# EasyEDA Pro project New Project_2025-09-08_15-52-52.eprj

# Schematic STM32F103C8T6最小系统板原理图
Board Name: Board1; Create Date: 2025-09-08; Page Name: P1; Project Name: New Project_2025-09-08_15-52-52; Schematic Name: STM32F103C8T6最小系统板原理图; Update Date: 2025-09-09; Company: 嘉立创EDA; Page Size: A4; Version: V1.0
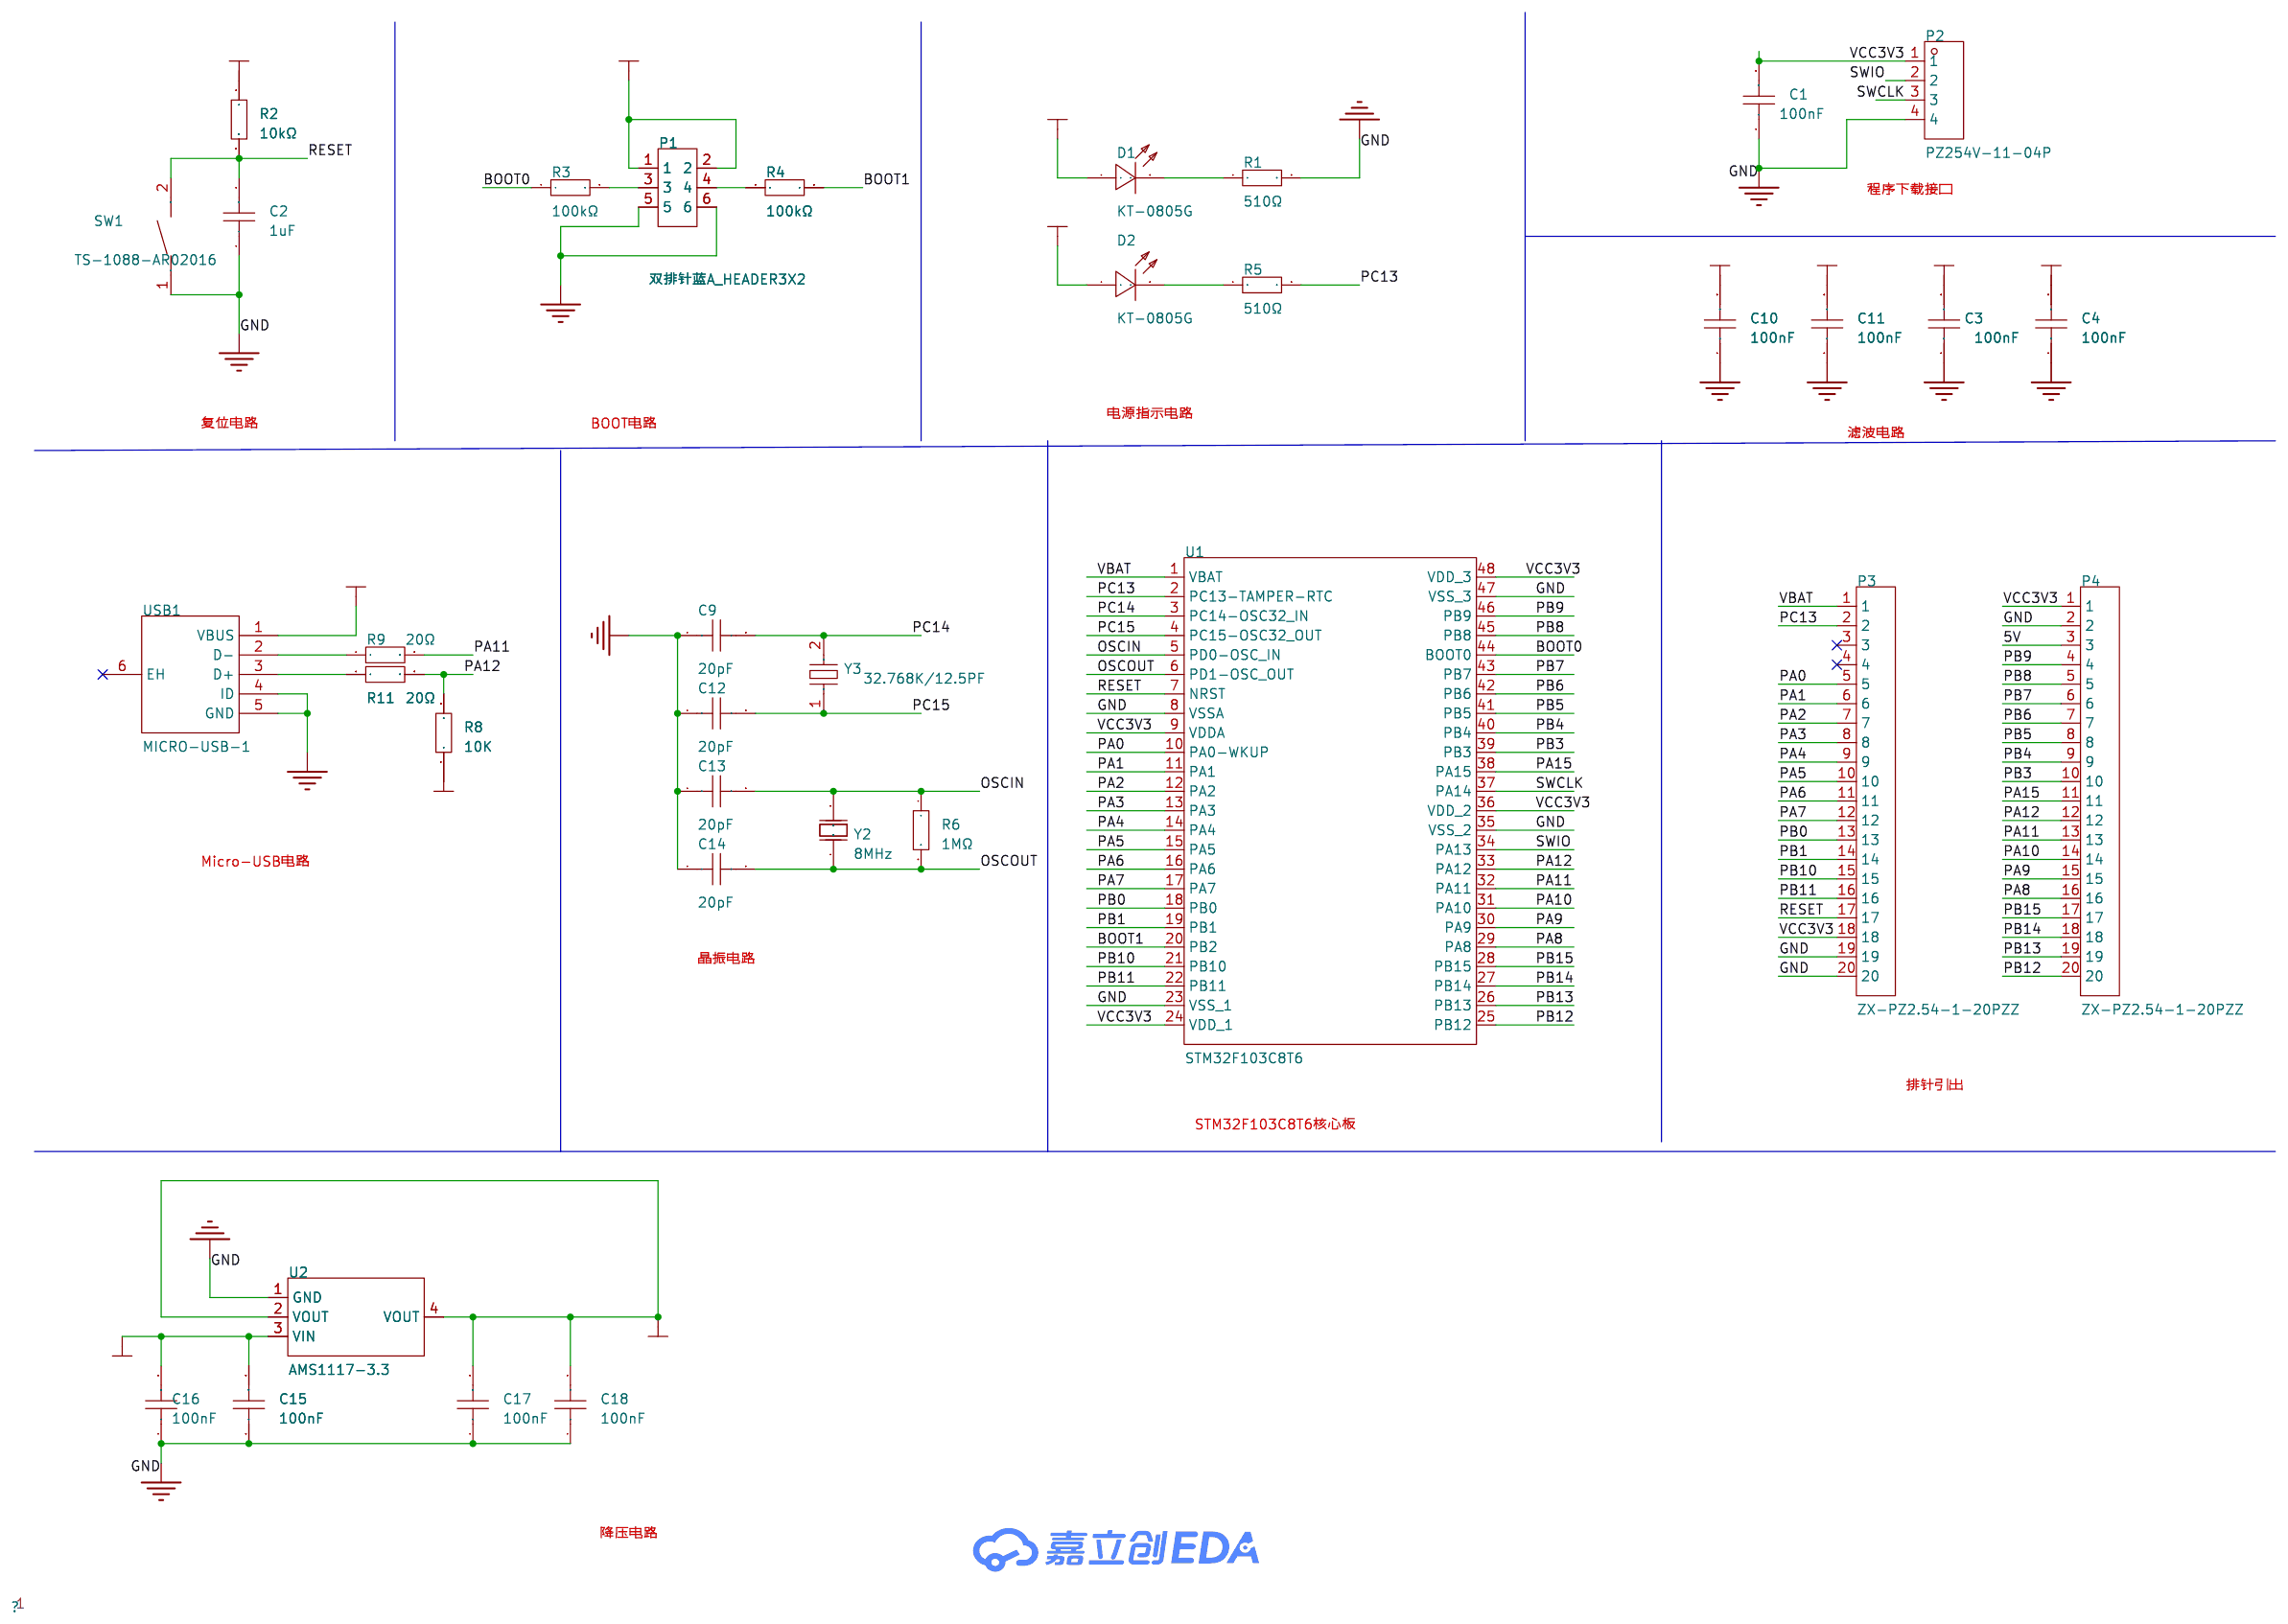
[diagram p0: schematic sheet]

## Parts
C1  100nF  [C0603]
C2  1uF  [C0603]
C3  100nF  [C0603]
C4  100nF  [C0603]
C9  20pF  [C0603]
C10  100nF  [C0603]
C11  100nF  [C0603]
C12  20pF  [C0603]
C13  20pF  [C0603]
C14  20pF  [C0603]
C15  100nF  [C0603]
C16  100nF  [C0603]
C17  100nF  [C0603]
C18  100nF  [C0603]
D1  KT-0805G  [LED0805-R-RD]
D2  KT-0805G  [LED0805-R-RD]
P1  双排针蓝A_HEADER3X2  [HDR-TH_6P-P2.54-V-M-R2-C3-S2.54-1]
P2  PZ254V-11-04P  [HDR-TH_4P-P2.54-V-M]
P3  ZX-PZ2.54-1-20PZZ  [HDR-TH_20P-P2.54-V-M]
P4  ZX-PZ2.54-1-20PZZ  [HDR-TH_20P-P2.54-V-M]
R1  510Ω  [R0603]
R2  10kΩ  [R0603]
R3  100kΩ  [R0603]
R4  100kΩ  [R0603]
R5  510Ω  [R0603]
R6  1MΩ  [R0603]
R8  10K  [R0603]
R9  20Ω  [R0603]
R11  20Ω  [R0603]
SW1  TS-1088-AR02016  [SW-SMD_L3.9-W3.0-P4.45]
U1  STM32F103C8T6  [LQFP-48_L7.0-W7.0-P0.50-LS9.0-BL]
U2  AMS1117-3.3  [SOT-223-3_L6.5-W3.4-P2.30-LS7.0-BR]
USB1  MICRO-USB-1  [MICRO-USB-SMD_C9900008946]
Y2  8MHz  [HC-49U_L10.9-W4.5-P4.88]
Y3  32.768K/12.5PF  [CRYSTAL-SMD_L3.2-W1.5-1]

## Library data of the parts
C1-C4 C9-C18 = CAP_0603: Supplier Footprint: 0603
D1 D2 = KT-0805G: LCSC Part Name: 0805 翠绿 高亮; Supplier Part: C2297; Manufacturer: KENTO; Supplier Footprint: 0805; JLCPCB Part Class: 基础库; Datasheet: https://item.szlcsc.com/datasheet/KT-0805G/2670.html; Supplier: LCSC; Illumination Color: 翠绿色; Voltage - Forward(Vf): 2.6V~3.1V; Power(Watts): 100mW; Forward Current: 5mA; Wavelength - Dominant: 513nm~528nm; Peak Wavelength: 525nm; Luminous Intensity: 430mcd; Viewing Angle: 120°; Operating Temperature: -40℃~+85℃
P1 = 双排针蓝A_HEADER3X2: Supplier Part: C9900019268; Supplier Footprint: HDR2X3_254M; JLCPCB Part Class: 扩展库; Supplier: LCSC
P2 = PZ254V-11-04P: LCSC Part Name: 1x4P 间距:2.54mm 方针 直插; Supplier Part: C2691448; Manufacturer: XFCN(兴飞); Supplier Footprint: 插件,P=2.54mm; JLCPCB Part Class: 扩展库; Datasheet: https://item.szlcsc.com/datasheet/PZ254V-11-04P/2801085.html; Supplier: LCSC; Pin Structure: 1x4P; Pitch: 2.54mm; Circluar Pins/Square Pins: 方针; Mounting Type: 直插; Number of Rows: 单排; Number of Pins: 4P; Current Rating: 3A; Voltage Rating (Max): 250V; Length of Mating Pin: 6mm; Insulation Height: 2.5mm; Length of End Connection Pin: 3mm; Operating Temperature: -40℃~+105℃; Color: 黑色
P3 P4 = ZX-PZ2.54-1-20PZZ: LCSC Part Name: 1x20P 间距:2.54mm 方针 直插; Supplier Part: C7501271; Manufacturer: Megastar(兆星); Supplier Footprint: 插件,P=2.54mm; JLCPCB Part Class: 扩展库; Datasheet: https://item.szlcsc.com/datasheet/ZX-PZ2.54-1-20PZZ/8582484.html; Supplier: LCSC; Pin Structure: 1x20P; Pitch: 2.54mm; Circluar Pins/Square Pins: 方针; Mounting Type: 直插; Number of Rows: 单排; Number of Pins: 20P; Current Rating: 3A; Length of Mating Pin: 6mm; Insulation Height: 2.5mm; Length of End Connection Pin: 3mm; Contact Material: 黄铜; Contact Plating: 金; Operating Temperature: -40℃~+105℃; Color: 黑色
R1-R6 R8 R9 R11 = Res_0603: Supplier Footprint: 0603
SW1 = TS-1088-AR02016: LCSC Part Name: 4*3*2mm 立贴 轻触开关; Supplier Part: C720477; Manufacturer: XUNPU(讯普); Supplier Footprint: SMD; JLCPCB Part Class: 基础库; Datasheet: https://item.szlcsc.com/datasheet/TS-1088-AR02016/763484.html; Supplier: LCSC; Circuit: 单刀单掷; Actuator Style: 圆形按钮; Operating Force: 1.6N; Mounting Type: 立贴; Length: 4mm; Width: 3mm; Switch Height: 2mm; with Bracket: 不带支架; Contact Current: 50mA; Voltage Rating: 12V; Actuator/Cap Color: 黑色; Termination Style: SMD接片; Life: 10万次; Operating Temperature: -30℃~+80℃
U1 = STM32F103C8T6: LCSC Part Name: 主流增强型ARM Cortex-M3 MCU，具有64 KB Flash、72 MHz CPU、电机控制、USB和CAN; Supplier Part: C8734; Manufacturer: ST(意法半导体); Supplier Footprint: LQFP-48(7x7); JLCPCB Part Class: 扩展库; Datasheet: https://item.szlcsc.com/datasheet/STM32F103C8T6/9243.html; Supplier: LCSC; CPU Core: ARM-M3; CPU Maximum Speed: 72MHz; Program Storage Size: 64KB; Program Memory Type: FLASH; Number of I/O: 37; ADC (Bit): 12bit; Voltage - Supply: 2V~3.6V
U2 = AMS1117-3.3_C6186: LCSC Part Name: 输出3.3V 1A; Supplier Part: C6186; Manufacturer: AMS; Supplier Footprint: SOT-223; JLCPCB Part Class: 基础库; Datasheet: https://item.szlcsc.com/datasheet/AMS1117-3.3/6652.html; Supplier: LCSC; Output Type: 固定; Voltage - Supply: 16V; Output Voltage: 3.3V; Output Current: 1A; Power Supply Rejection Ratio (PSRR): 72dB@(120Hz); Voltage Dropout: 1.1V@(800mA); standby current: 5mA; Features: 过流保护；过热保护; Operating Temperature: -40℃~+125℃; Output Configuration: 正极; Number of Outputs: 1
USB1 = MICRO-USB-1: Supplier Part: C9900008946; Supplier Footprint: USB-micro; JLCPCB Part Class: 扩展库; Supplier: LCSC
Y2 = ATS080SM-1: LCSC Part Name: 8MHz ±30ppm; Supplier Part: C1985742; Manufacturer: CTS(西迪斯); Supplier Footprint: HC-49S; JLCPCB Part Class: 扩展库; Datasheet: https://atta.szlcsc.com/upload/public/pdf/source/20220124/B9986DAB42ECDE31CA8A9C6A4A6F535C.pdf; Supplier: LCSC; Normal temperature Frequency Tolerance: ±30ppm; Frequency Stability(Full temperature range): ±50ppm; Equivalent Series Resistance (ESR): 60Ω; Operating Temperature: -20℃~+70℃
Y3 = 32.768K/12.5PF: Supplier Part: C9900014970; Supplier Footprint: 32.768KHz; JLCPCB Part Class: 扩展库; Supplier: LCSC

## Nets
5V: C15.2 C16.2 P4.3 R8.1 U2.3(VIN) USB1.1(VBUS)
GND: C1.1 C2.1 C3.1 C4.1 C9.1 C10.1 C11.1 C12.1 C13.1 C14.1 C15.1 C16.1 C17.1 C18.1 P1.5 P1.6 P2.4 P3.19 P3.20 P4.2 R1.2 SW1.1 U1.8(VSSA) U1.23(VSS_1) U1.35(VSS_2) U1.47(VSS_3) U2.1(GND) USB1.4(ID) USB1.5(GND)
VBAT: P3.1 U1.1(VBAT)
VCC3V3: C1.2 C3.2 C4.2 C10.2 C11.2 C17.2 C18.2 D1.1(A) D2.1(A) P1.1 P1.2 P2.1 P3.18 P4.1 R2.1 U1.9(VDDA) U1.24(VDD_1) U1.36(VDD_2) U1.48(VDD_3) U2.2(VOUT) U2.4(VOUT)
BOOT0: R3.1 U1.44(BOOT0)
BOOT1: R4.2 U1.20(PB2)
OSCIN: C13.2 R6.1 U1.5(PD0-OSC_IN) Y2.2(OSC2)
OSCOUT: C14.2 R6.2 U1.6(PD1-OSC_OUT) Y2.1(OSC1)
PA0: P3.5 U1.10(PA0-WKUP)
PA1: P3.6 U1.11(PA1)
PA2: P3.7 U1.12(PA2)
PA3: P3.8 U1.13(PA3)
PA4: P3.9 U1.14(PA4)
PA5: P3.10 U1.15(PA5)
PA6: P3.11 U1.16(PA6)
PA7: P3.12 U1.17(PA7)
PA8: P4.16 U1.29(PA8)
PA9: P4.15 U1.30(PA9)
PA10: P4.14 U1.31(PA10)
PA11: P4.13 R9.2 U1.32(PA11)
PA12: P4.12 R8.2 R11.2 U1.33(PA12)
PA15: P4.11 U1.38(PA15)
PB0: P3.13 U1.18(PB0)
PB1: P3.14 U1.19(PB1)
PB3: P4.10 U1.39(PB3)
PB4: P4.9 U1.40(PB4)
PB5: P4.8 U1.41(PB5)
PB6: P4.7 U1.42(PB6)
PB7: P4.6 U1.43(PB7)
PB8: P4.5 U1.45(PB8)
PB9: P4.4 U1.46(PB9)
PB10: P3.15 U1.21(PB10)
PB11: P3.16 U1.22(PB11)
PB12: P4.20 U1.25(PB12)
PB13: P4.19 U1.26(PB13)
PB14: P4.18 U1.27(PB14)
PB15: P4.17 U1.28(PB15)
PC13: P3.2 R5.2 U1.2(PC13-TAMPER-RTC)
PC14: C9.2 U1.3(PC14-OSC32_IN) Y3.2
PC15: C12.2 U1.4(PC15-OSC32_OUT) Y3.1
RESET: C2.2 P3.17 R2.2 SW1.2 U1.7(NRST)
SWCLK: P2.3 U1.37(PA14)
SWIO: P2.2 U1.34(PA13)
$1N1147: P1.3 R3.2
$1N1213: P1.4 R4.1
$1N1574: D1.2(K) R1.1
$1N1677: D2.2(K) R5.1
$1N2421: R9.1 USB1.2(D-)
$1N2425: R11.1 USB1.3(D+)

Not connected (* = marked no-connect by the designer): P3 3* 4*; USB1 6(EH)*

## Notes on the sheet
- 程序下载接口
- 复位电路
- BOOT电路
- 电源指示电路
- 滤波电路
- Micro-USB电路
- 晶振电路
- 排针引出
- STM32F103C8T6核心板
- 降压电路

# Board PCB1
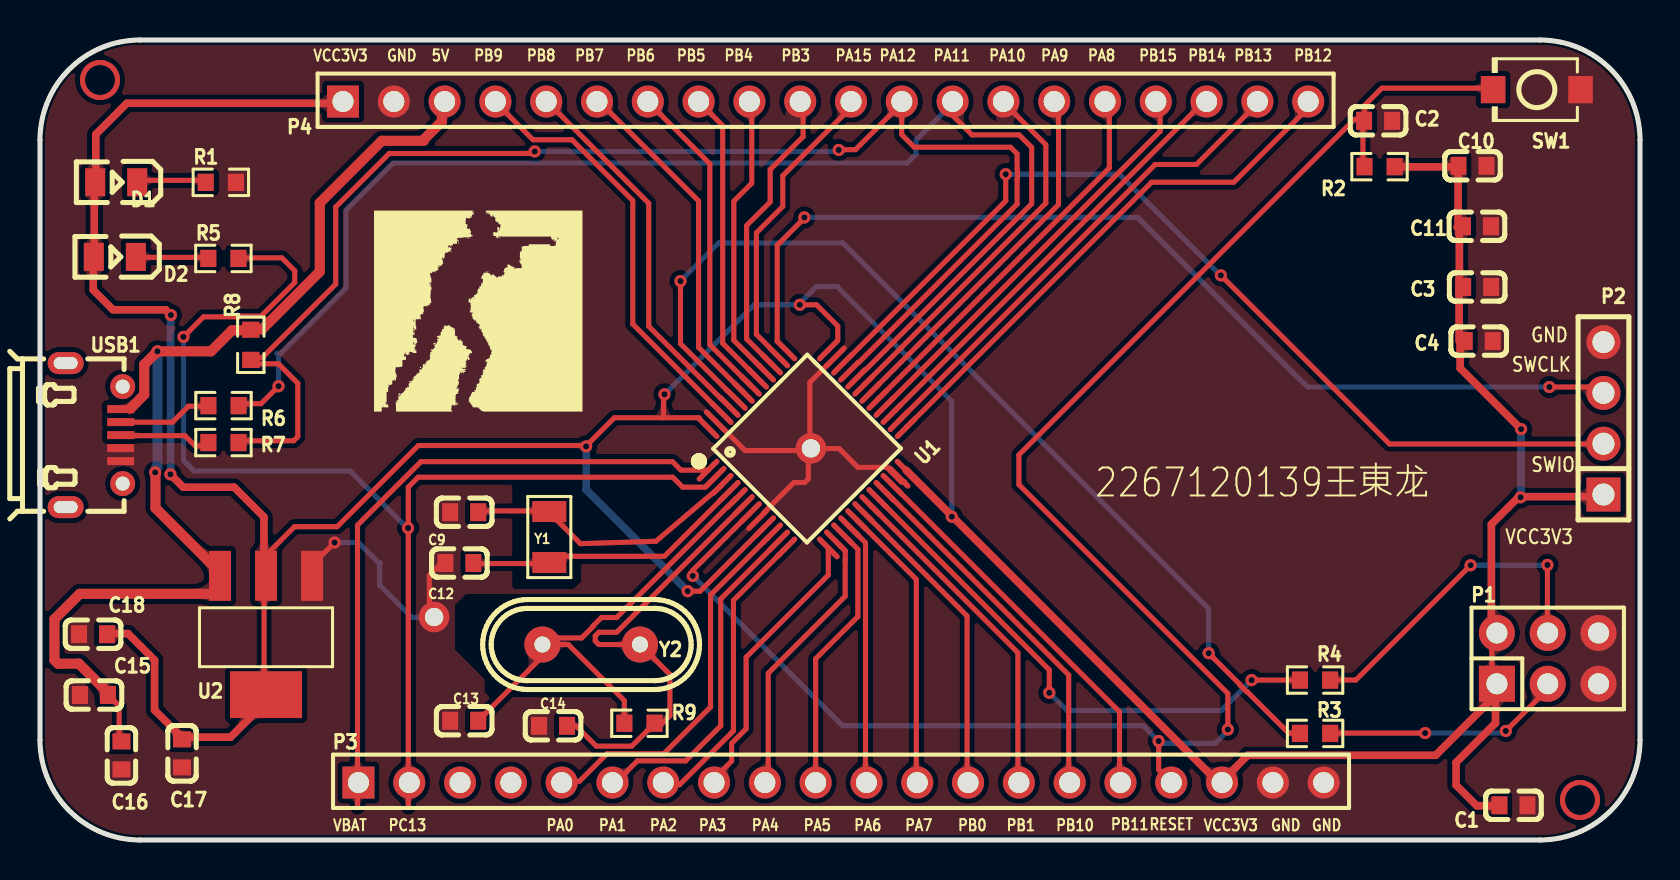
[diagram p1: board, top side]
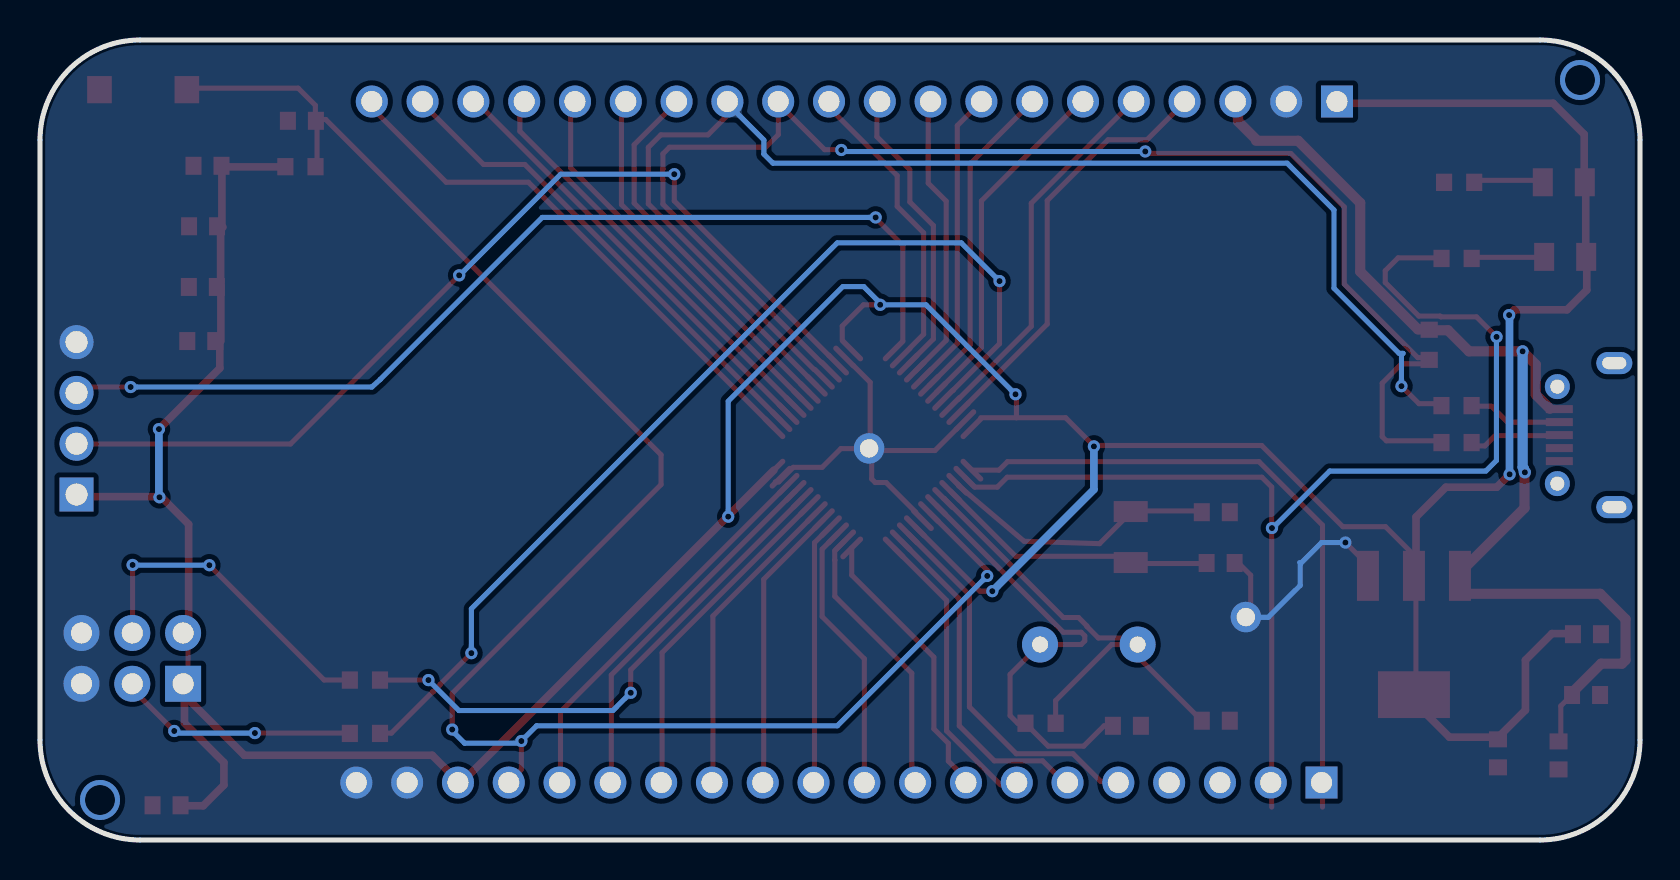
[diagram p2: board, bottom side, seen from below]

Outline 80 x 40 mm; copper layers: Top Layer, Bottom Layer. Coordinates in mm from the lower left corner of the outline.
Outline path: 0,35 0,5 arc(1.46,1.46) 5,0 75,0 arc(78.54,1.46) 80,5 80,35 arc(78.54,38.54) 75,40 5,40 arc(1.46,38.54) 0,35
Stack: Top Layer 0.035mm / Dielectric1 1.51mm FR4 er 4.5 / Bottom Layer 0.035mm

## Design rules (mm)
template: 自定义配置
spacing copperThickness1oz (default): track to track 0.102, other pairs 0.152 to 0.3
spacing copperThickness2oz: track to track 0.203, other pairs 0.152 to 0.3
track width copperThickness1oz (default): min 0.127, default 0.254, max 2.54
track width copperThickness2oz: min 0.203, default 0.254, max 2.54
differential pair differentialPair (default): width min 0.127, default 0.254, max 2.54; gap min 0.152, default 0.152
via viaSize (default): diameter min 0.5, default 0.61, max 10; hole min 0.3, default 0.305, max 6.3

## Placement (name value [footprint] x y rotation side)
C1  100nF  [C0603]  73.67 1.74 180 top
C2  1uF  [C0603]  66.91 35.96 180 top
C3  100nF  [C0603]  71.86 27.65 180 top
C4  100nF  [C0603]  71.94 24.95 180 top
C9  20pF  [C0603]  21.21 16.39 0 top
C10  100nF  [C0603]  71.62 33.71 180 top
C11  100nF  [C0603]  71.85 30.69 180 top
C12  20pF  [C0603]  20.97 13.85 0 top
C13  20pF  [C0603]  21.21 5.96 0 top
C14  20pF  [C0603]  25.65 5.71 0 top
C15  100nF  [C0603]  2.7 7.25 0 top
C16  100nF  [C0603]  4.07 4.23 90 top
C17  100nF  [C0603]  7.1 4.33 90 top
C18  100nF  [C0603]  2.65 10.29 0 top
D1  KT-0805G  [LED0805-R-RD]  3.81 32.89 180 top
D2  KT-0805G  [LED0805-R-RD]  3.74 29.16 180 top
NOREF  -  [Pad_e1723]  38.55 19.58 0 top
NOREF#2  -  [Pad_e2042]  19.71 11.15 0 top
P1  双排针蓝A_HEADER3X2  [HDR-TH_6P-P2.54-V-M-R2-C3-S2.54-1]  75.39 9.08 0 top
P2  PZ254V-11-04P  [HDR-TH_4P-P2.54-V-M]  78.17 21.08 90 top
P3  ZX-PZ2.54-1-20PZZ  [HDR-TH_20P-P2.54-V-M]  40.05 2.87 0 top
P4  ZX-PZ2.54-1-20PZZ  [HDR-TH_20P-P2.54-V-M]  39.28 36.92 0 top
R1  510Ω  [R0603]  9.04 32.88 0 top
R2  10kΩ  [R0603]  66.98 33.67 180 top
R3  100kΩ  [R0603]  63.75 5.33 0 top
R4  100kΩ  [R0603]  63.75 8 180 top
R5  510Ω  [R0603]  9.17 29.08 0 top
R6  10K  [R0603]  9.17 21.72 0 top
R7  10K  [R0603]  9.17 19.87 0 top
R8  10K  [R0603]  10.54 24.76 270 top
R9  1MΩ  [R0603]  29.97 5.84 0 top
SW1  TS-1088-AR02016  [SW-SMD_L3.9-W3.0-P4.45]  74.84 37.52 180 top
U1  STM32F103C8T6  [LQFP-48_L7.0-W7.0-P0.50-LS9.0-BL]  38.35 19.55 315 top
U2  AMS1117-3.3  [SOT-223-3_L6.5-W3.4-P2.30-LS7.0-BR]  11.3 10.24 90 top
USB1  MICRO-USB-1  [MICRO-USB-SMD_C9900008946]  2.71 20.25 270 top
Y1  32.768K/12.5PF  [CRYSTAL-SMD_L3.2-W1.5-1]  25.46 15.15 90 top
Y2  8MHz  [HC-49U_L10.9-W4.5-P4.88]  27.56 9.77 180 top

## Footprints (pads in the part's own frame, mm; a bottom-side part is the same pattern mirrored in y, then rotated)
C0603
  rect 0.8x0.9 smd: 1(-0.7,0) 2(0.7,0)
CRYSTAL-SMD_L3.2-W1.5-1
  rect 1.05x1.7 smd: 1(-1.275,0) 2(1.275,0)
HC-49U_L10.9-W4.5-P4.88
  round 1.8 hole 0.8: 1(-2.44,0) 2(2.44,0)
HDR-TH_4P-P2.54-V-M
  rect 1.7x1.7 hole 1.1: 1(-3.81,0)
  round 1.7 hole 1.1: 2(-1.27,0) 3(1.27,0) 4(3.81,0)
HDR-TH_6P-P2.54-V-M-R2-C3-S2.54-1
  rect 1.8x1.8 hole 1.05: 1(-2.54,-1.27)
  round 1.8 hole 1.05: 2(-2.54,1.27) 3(0,-1.27) 4(0,1.27) 5(2.54,-1.27) 6(2.54,1.27)
HDR-TH_20P-P2.54-V-M
  rect 1.6x1.6 hole 1.05: 1(-24.13,0)
  round 1.6 hole 1.05: 2(-21.59,0) 3(-19.05,0) 4(-16.51,0) 5(-13.97,0) 6(-11.43,0) 7(-8.89,0) 8(-6.35,0) 9(-3.81,0) 10(-1.27,0) 11(1.27,0) 12(3.81,0) 13(6.35,0) 14(8.89,0) 15(11.43,0) 16(13.97,0) 17(16.51,0) 18(19.05,0) 19(21.59,0) 20(24.13,0)
LED0805-R-RD
  rect 1x1.399 smd: 1(1.05,0) 2(-1.05,0)
LQFP-48_L7.0-W7.0-P0.50-LS9.0-BL
  oval 0.27x1.5 smd: 1(-2.75,-4.25) 2(-2.25,-4.25) 3(-1.75,-4.25) 4(-1.25,-4.25) 5(-0.75,-4.25) 6(-0.25,-4.25) 7(0.25,-4.25) 8(0.75,-4.25) 9(1.25,-4.25) 10(1.75,-4.25) 11(2.25,-4.25) 12(2.75,-4.25) 25(2.75,4.25) 26(2.25,4.25) 27(1.75,4.25) 28(1.25,4.25) 29(0.75,4.25) 30(0.25,4.25) 31(-0.25,4.25) 32(-0.75,4.25) 33(-1.25,4.25) 34(-1.75,4.25) 35(-2.25,4.25) 36(-2.75,4.25)
  oval 1.5x0.27 smd: 13(4.25,-2.75) 14(4.25,-2.25) 15(4.25,-1.75) 16(4.25,-1.25) 17(4.25,-0.75) 18(4.25,-0.25) 19(4.25,0.25) 20(4.25,0.75) 21(4.25,1.25) 22(4.25,1.75) 23(4.25,2.25) 24(4.25,2.75) 37(-4.25,2.75) 38(-4.25,2.25) 39(-4.25,1.75) 40(-4.25,1.25) 41(-4.25,0.75) 42(-4.25,0.25) 43(-4.25,-0.25) 44(-4.25,-0.75) 45(-4.25,-1.25) 46(-4.25,-1.75) 47(-4.25,-2.25) 48(-4.25,-2.75)
MICRO-USB-SMD_C9900008946
  rect 0.4x1.35 smd: 1(-1.3,1.325) 2(-0.65,1.325) 3(0,1.325) 4(0.65,1.325) 5(1.3,1.325)
  oval 1.1x1.8 hole 0.6x1.2: 6(-3.6,-1.425) 6(3.6,-1.425)
  round 1.25 hole 0.7: 6(-2.425,1.425) 6(2.425,1.425)
Pad_e1723
  round 1.524 hole 0.914: 1(0,0)
Pad_e2042
  round 1.524 hole 0.914: 1(0,0)
R0603
  rect 0.806x0.864 smd: 1(-0.753,0) 2(0.753,0)
SOT-223-3_L6.5-W3.4-P2.30-LS7.0-BR
  rect 2.5x1.1 smd: 1(2.97,-2.3) 2(2.97,0) 3(2.97,2.3)
  rect 2.34x3.6 smd: 4(-2.97,0)
SW-SMD_L3.9-W3.0-P4.45
  rect 1.23x1.36 smd: 1(-2.185,0) 2(2.185,0)

## Nets
5V: C15.2 C16.2 P4.3 R8.1 U2.3 USB1.1
GND: C1.1 C2.1 C3.1 C4.1 C9.1 C10.1 C11.1 C12.1 C13.1 C14.1 C15.1 C16.1 C17.1 C18.1 NOREF.1 NOREF#2.1 P1.5 P1.6 P2.4 P3.19 P3.20 P4.2 R1.2 SW1.1 U1.8 U1.23 U1.35 U1.47 U2.1 USB1.4 USB1.5
VBAT: P3.1 U1.1
VCC3V3: C1.2 C3.2 C4.2 C10.2 C11.2 C17.2 C18.2 D1.1 D2.1 P1.1 P1.2 P2.1 P3.18 P4.1 R2.1 U1.9 U1.24 U1.36 U1.48 U2.2 U2.4
BOOT0: R3.1 U1.44
BOOT1: R4.2 U1.20
OSCIN: C13.2 R9.1 U1.5 Y2.2
OSCOUT: C14.2 R9.2 U1.6 Y2.1
PA0: P3.5 U1.10
PA1: P3.6 U1.11
PA2: P3.7 U1.12
PA3: P3.8 U1.13
PA4: P3.9 U1.14
PA5: P3.10 U1.15
PA6: P3.11 U1.16
PA7: P3.12 U1.17
PA8: P4.16 U1.29
PA9: P4.15 U1.30
PA10: P4.14 U1.31
PA11: P4.13 R6.2 U1.32
PA12: P4.12 R7.2 R8.2 U1.33
PA15: P4.11 U1.38
PB0: P3.13 U1.18
PB1: P3.14 U1.19
PB3: P4.10 U1.39
PB4: P4.9 U1.40
PB5: P4.8 U1.41
PB6: P4.7 U1.42
PB7: P4.6 U1.43
PB8: P4.5 U1.45
PB9: P4.4 U1.46
PB10: P3.15 U1.21
PB11: P3.16 U1.22
PB12: P4.20 U1.25
PB13: P4.19 U1.26
PB14: P4.18 U1.27
PB15: P4.17 U1.28
PC13: P3.2 R5.2 U1.2
PC14: C9.2 U1.3 Y1.2
PC15: C12.2 U1.4 Y1.1
RESET: C2.2 P3.17 R2.2 SW1.2 U1.7
SWCLK: P2.3 U1.37
SWIO: P2.2 U1.34
$1N1147: P1.3 R3.2
$1N1213: P1.4 R4.1
$1N1574: D1.2 R1.1
$1N1677: D2.2 R5.1
$1N2421: R6.1 USB1.2
$1N2425: R7.1 USB1.3

Pads without a net: P3 3 4; USB1 6

## Via types
v1: diameter 2, hole 1.5, Top Layer to Bottom Layer, 2 vias
v2: diameter 0.61, hole 0.305, Top Layer to Bottom Layer, 32 vias

## Routing (per net, layer and track width the routed paths; a pad name or vN(x,y) marks a point on that pad's centre or on a via; arc(x,y) is an arc through that point)
5V: length 53.5
  Top Layer w0.254: 3.59,7.07 3.96,6.7 3.96,5.3
  Top Layer w0.508: 19.2,35.03 20.1,35.93 20.1,36.94 ; v2(5.76,18.38) 5.77,18.37 5.77,16.6 8.81,13.56 ; 3.34,7.42 1.94,8.82 0.9,8.82 0.72,9 0.72,11.04 1.99,12.31 9.05,12.31 ; 19.2,34.96 17.09,34.96 13.99,31.86 13.99,28.42 11.1,25.53 10.55,25.53 ; 4.51,21.56 5.21,22.27 5.21,23.77 v2(5.87,24.43) 8.55,24.43 9.6,25.49 10.39,25.49
  Bottom Layer w0.508: v2(5.87,24.43) 5.87,18.64 5.81,18.58 5.81,18.43 v2(5.76,18.38)
GND: length 29.8
  Top Layer w0.254: 19.47,11.41 19.47,13.24 20.19,13.96 ; 36.21,16.39 37.69,17.87 38.24,17.87 38.42,18.05 38.42,19.54 38.4,19.56 ; 39.34,23.73 38.49,22.88 38.49,19.77 ; 38.28,19.47 35.25,19.47 34.17,20.56 ; 13.86,13.94 13.86,14.01 v2(14.73,14.87) ; 43.23,17.91 43.06,17.91 42.33,18.63 40.89,18.63 39.96,19.57 38.58,19.57
  Bottom Layer w0.254: 16.99,12.72 16.99,13.84 17.02,13.87 ; 17,12.72 18.59,11.13 19.58,11.13 ; v2(14.73,14.87) 15.92,14.87 16.97,13.83
VBAT: length 33.1
  Top Layer w0.254: 15.88,1.65 15.88,15.74 19.05,18.92 31.62,18.92 32.05,18.49 U1.1
VCC3V3: length 202.3
  Top Layer w0.254: 32.96,21.11 31.18,21.11 ; 31.18,21.11 31.18,22.24 v2(31.22,22.28) ; 31.18,21.11 28.72,21.11 27.29,19.69 ; 72.59,9.59 72.59,8.53 72.65,8.47 ; 39.89,24.98 39.89,25.7 38.82,26.76 v2(37.99,26.76) ; 11.45,14.39 12.72,15.67 14.86,15.67 18.92,19.72 27.22,19.72 ; v2(32.38,12.44) 33.01,12.44 U1.9 ; 70.92,30.71 70.93,30.69 ; 11.2,12.57 11.2,7.8 11.45,7.56 ; 70.9,33.74 70.9,33.69 ; 70.92,33.69 70.9,33.67
  Top Layer w0.381: 59.18,2.72 59.08,2.72 U1.24 ; 3.54,10.32 4.4,10.32 5.73,8.99 5.73,6.5 7,5.22 ; v2(74.05,20.55) 71.01,23.59 71.01,24.81 ; 59.03,2.87 60.39,4.24 69.78,4.24 72.59,7.04 ; 10.99,6.7 10.99,6.6 9.53,5.14 7.06,5.14 ; 2.71,32.83 2.71,29.39 2.61,29.29 ; 70.96,24.94 70.96,27.73 ; v2(6.52,18.28) 7.16,17.64 9.71,17.64 11.2,16.15 11.2,14.31 ; 67.89,33.66 70.89,33.66 ; v2(6.54,26.25) 6.28,26.51 3.65,26.51 2.66,27.5 2.66,28.8 ; 2.79,33.27 2.79,35.28 4.34,36.84 14.94,36.84 ; 70.97,27.92 70.97,30.53 70.85,30.64 ; 72.78,7.46 72.78,5.85 70.8,3.88 70.8,2.75 71.84,1.71 72.78,1.71 ; 70.9,33.67 70.9,30.72 ; 77.62,17.17 73.95,17.17 72.57,15.79 72.57,10.61 ; 71.06,24.84 71.05,24.85 71.16,24.97
  Bottom Layer w0.254: 37.9,26.76 35.7,26.76 v2(31.22,22.28) ; 37.95,26.8 38.81,27.67 39.86,27.67 45.59,21.94 v2(45.59,16.17)
  Bottom Layer w0.381: v2(6.54,26.25) 6.53,26.23 6.53,18.29 v2(6.52,18.28) ; v2(32.38,12.44) 27.31,17.52 v2(27.31,19.68) ; v2(74.03,17.14) 74.05,17.16 v2(74.05,20.55)
(no net):
  vias: v1(3,38) v1(77,2)
BOOT0: length 49.5
  Top Layer w0.254: 34.33,22.49 34.33,22.51 32.02,24.81 v2(32.02,27.94) ; v2(58.43,9.34) 60,7.78 60,7.75 60.34,7.41 60.36,7.41 62.43,5.34 62.82,5.34
  Bottom Layer w0.254: v2(32.02,27.94) 33.94,29.86 40.13,29.86 58.43,11.56 v2(58.43,9.34)
BOOT1: length 26.8
  Top Layer w0.254: U1.20 50.46,8.5 v2(50.46,7.36) ; v2(60.58,8) R4.2
  Bottom Layer w0.254: v2(60.58,8) 59.06,6.47 51.35,6.47 v2(50.46,7.36)
OSCIN: length 24.3
  Top Layer w0.254: Y2.2 25.12,9.17 C13.2 ; Y2.2 26.42,9.77 29.22,6.97 R9.1 ; Y2.2 25.45,10.1 27.08,10.1 27.65,10.67 27.65,10.7 28.07,11.12 28.83,11.12 34.79,17.08 U1.5
OSCOUT: length 23
  Top Layer w0.254: U1.6 28.83,10.39 27.94,10.39 27.76,10.21 27.76,9.95 27.94,9.77 Y2.1 31.5,8.28 31.5,6.22 31.12,5.84 R9.2 30.73,5.83 29.59,4.69 27.81,4.69 26.8,5.71 C14.2
PA0: length 18.8
  Top Layer w0.254: 26.14,2.94 26.97,2.94 28.35,4.31 31.19,4.31 33.53,6.65 33.53,12.25 U1.10
PA1: length 17.3
  Top Layer w0.254: 28.74,2.83 29.87,3.96 32.28,3.96 34.04,5.71 34.04,12.05 U1.11 ; 28.74,2.83 28.57,2.66 ; 28.74,2.83 28.74,2.96
PA2: length 15
  Top Layer w0.254: 30.98,2.77 31.98,2.77 34.67,5.46 34.67,11.98 U1.12
PA3: length 14.1
  Top Layer w0.254: U1.13 39.41,13.25 35.31,9.14 35.31,5.56 34.58,4.83 34.58,3.94 33.77,3.13 33.77,2.84
PA4: length 14.2
  Top Layer w0.254: 36.17,2.69 36.41,2.94 36.41,8.34 40.26,12.19 40.26,13.99 40.26,14 40.26,14.46 U1.14
PA5: length 13.7
  Top Layer w0.254: 38.72,2.91 38.76,2.87 P3.10 38.78,9.06 40.89,11.17 40.89,14.54 U1.15
PA6: length 13.1
  Top Layer w0.254: U1.16 41.28,14.86 41.28,2.97 41.34,2.91
PA7: length 14.4
  Top Layer w0.254: 43.89,2.86 43.81,2.93 43.81,13.03 U1.17
PA8: length 19.5
  Top Layer w0.254: 53.39,36.71 53.47,36.62 53.47,33.61 U1.29
PA9: length 18.3
  Top Layer w0.254: U1.30 50.93,31.77 50.93,36.57 50.77,36.73
PA10: length 18.7
  Top Layer w0.254: 41.18,22.73 50.29,31.84 50.29,34.76 48.3,36.75 48.17,36.75
PA11: length 65.1
  Top Layer w0.254: 10.11,21.82 11.05,21.82 v2(11.93,22.69) ; 45.62,36.77 45.62,36.24 46.6,35.26 48.96,35.26 49.58,34.63 49.58,31.81 41.3,23.52
  Bottom Layer w0.254: v2(11.93,22.69) 11.93,24.25 11.85,24.33 12.04,24.33 15.3,27.59 15.3,31.5 17.64,33.84 43.36,33.84 43.81,34.3 43.81,35 45.56,36.76
PA12: length 69.7
  Top Layer w0.254: v2(24.74,34.43) 24.64,34.33 17.46,34.33 14.79,31.65 14.79,27.79 11.11,24.12 10.54,24.12 ; 39.91,34.52 40.77,34.52 43.13,36.87 ; 10.74,23.81 11.92,23.81 12.89,22.84 12.89,20.17 12.68,19.96 10.04,19.96 ; 43.08,36.78 43.08,35.27 43.72,34.64 48.53,34.64 48.85,34.31 48.85,33.55 48.87,33.53 48.87,33.05 48.85,33.03 48.85,31.79 40.92,23.86
  Bottom Layer w0.254: v2(39.93,34.5) 39.86,34.42 24.74,34.42 v2(24.74,34.43)
PA15: length 14.4
  Top Layer w0.254: 36.47,24.64 35.82,25.29 35.82,30.36 37.14,31.68 37.14,33.22 40.46,36.54 40.46,36.83
PB0: length 15.6
  Top Layer w0.254: U1.18 46.35,11.2 46.35,3.01 46.43,2.94
PB1: length 17
  Top Layer w0.254: 48.98,2.84 48.9,2.93 48.9,9.37 U1.19
PB3: length 14.7
  Top Layer w0.254: 38.06,36.76 38.16,36.67 38.16,35.17 36.51,33.52 36.51,31.9 35.33,30.72 35.33,25.05 U1.39
PB4: length 14.8
  Top Layer w0.254: 35.33,37.17 35.59,36.91 35.59,32.84 34.69,31.94 34.69,24.98 U1.40
PB5: length 14.8
  Top Layer w0.254: 33.15,36.71 34.13,35.72 34.13,24.83 U1.41
PB6: length 16
  Top Layer w0.254: 35.53,22.73 35.52,22.73 33.49,24.76 33.49,33.81 30.61,36.69
PB7: length 17.4
  Top Layer w0.254: U1.43 35.17,22.38 32.93,24.63 32.93,31.95 28.07,36.82
PB8: length 18.3
  Top Layer w0.254: 25.53,36.75 30.44,31.84 30.44,25.68 34.1,22.02
PB9: length 20.1
  Top Layer w0.254: 23.18,36.49 24.65,35.01 26.6,35.01 29.64,31.97 29.64,25.8 33.61,21.83 33.61,21.8
PB10: length 18.5
  Top Layer w0.254: U1.21 42.25,17.43 51.44,8.25 51.44,2.91 51.53,2.81
PB11: length 19.7
  Top Layer w0.254: U1.22 53.97,6.41 53.97,2.92 54.08,2.81
PB12: length 27.6
  Top Layer w0.254: U1.25 55.58,32.89 59.69,32.89 63.63,36.83 63.63,37.38
PB13: length 24.8
  Top Layer w0.254: U1.26 55.76,33.78 57.82,33.78 60.94,36.89 60.94,36.68
PB14: length 22.6
  Top Layer w0.254: 58.43,37.16 58.48,37.16 ; 58.43,37.16 U1.27 ; 58.43,37.16 58.55,37.27
PB15: length 21
  Top Layer w0.254: 55.86,36.87 56.01,36.73 56.01,35.44 U1.28
PC13: length 60.9
  Top Layer w0.254: 10.07,29.11 12.1,29.11 12.74,28.46 12.74,27.87 11.06,26.2 9.99,26.2 9.95,26.16 8.17,26.16 v2(7.17,25.16) ; 18.41,1.65 18.41,17.65 18.91,18.14 31.64,18.14 32.14,17.64 33.26,17.64 33.76,18.14
  Bottom Layer w0.254: v2(18.4,15.6) 18.36,15.6 15.51,18.45 7.71,18.45 7.18,18.98 7.18,24.95 7.08,25.04
PC14: length 13.3
  Top Layer w0.254: U1.3 34.06,17.74 34.06,17.71 30.79,14.94 27.02,14.82 25.46,16.37 Y1.2 ; 24.93,16.4 24.88,16.45 22.04,16.45
PC15: length 13.9
  Top Layer w0.254: 21.72,13.82 25.01,13.82 25.07,13.89 ; Y1.1 25.78,14.19 31.22,14.19 U1.4
RESET: length 89.1
  Top Layer w0.254: U1.7 32.64,13.48 v2(32.64,13.2) ; v2(55.93,4.95) 55.93,3.52 56.59,2.86 ; 72.51,37.52 72.44,37.59 67.09,37.59 66.23,36.73 66.23,36.1 ; 66.15,33.7 66.15,36.03 65.72,36.03 48.95,19.26 48.95,17.77 59.39,7.33 v2(59.39,5.52)
  Bottom Layer w0.254: v2(32.64,13.2) 40.13,5.71 55.17,5.71 v2(55.93,4.95) 56.05,4.83 ; 59.48,5.54 58.77,4.84 56.07,4.84
SWCLK: length 50.1
  Top Layer w0.254: 78.01,22.34 77.69,22.65 v2(75.47,22.65) ; 36.86,25 36.86,29.74 38.21,31.08
  Bottom Layer w0.254: v2(75.47,22.65) 63.41,22.65 63,23.02 54.89,31.13 v2(38.22,31.13)
SWIO: length 47.8
  Top Layer w0.254: v2(59.04,28.23) 67.47,19.8 78.28,19.8 ; 40.55,24.22 48.29,31.95 v2(48.29,33.29)
  Bottom Layer w0.254: 58.96,28.29 53.96,33.29 v2(48.29,33.29)
$1N1147: length 11.7
  Top Layer w0.254: v2(73.29,5.45) 75.27,7.43 75.27,7.69 ; 64.65,5.35 v2(69.26,5.35)
  Bottom Layer w0.254: v2(73.29,5.45) 73.19,5.35 v2(69.26,5.35)
$1N1213: length 16.4
  Top Layer w0.254: v2(75.37,13.75) 75.37,10.6 75.27,10.5 ; v2(71.53,13.74) 65.79,8 64.65,8
  Bottom Layer w0.254: v2(75.37,13.75) 75.36,13.74 v2(71.53,13.74)
$1N1574: length 3.4
  Top Layer w0.254: 4.85,32.98 8.26,32.98
$1N1677: length 3.3
  Top Layer w0.254: 4.95,29.13 8.28,29.13
$1N2421: length 4.1
  Top Layer w0.254: 8.19,21.75 8.13,21.69 7.42,21.69 6.62,20.89 4.47,20.89
$1N2425: length 4.2
  Top Layer w0.254: 4.51,20.22 7.25,20.22 7.76,19.7 8.45,19.7

## Copper pours and planes (outline as drawn; the poured copper is in the pictures)
GND on Top Layer: -7.05,44.05 88.61,44.05 88.61,-6.09 -7.05,-6.09
GND on Top Layer: -8.11,47.07 78.19,47.07 78.19,-3.13 -8.11,-3.13
GND on Top Layer: -22.99,62.48 89.59,62.48 89.59,-7.44 -22.99,-7.44
GND on Bottom Layer: -23.2,58.22 86.42,58.22 86.42,-8 -23.2,-8

Small or netless copper shapes (teardrops, artwork), in the pictures only: 163 on Top Layer, 30 on Bottom Layer

## Text on the board
Top Silkscreen Layer: VCC3V3 | VBAT | GND | PC13 | 5V | PB9 | PB8 | PA0 | PB7 | PA1 | PB6 | PA2 | PB5 | PA3 | PB4 | PA4 | PB3 | PA5 | PA15 | PA6 | PA12 | PA7 | PA11 | PB0 | PA10 | PB1 | PA9 | PB10 | PA8 | PB11 | PB15 | RESET | PB14 | PB13 | PB12 | SWCLK | SWIO | 2267120139王東龙

# Board PCB3
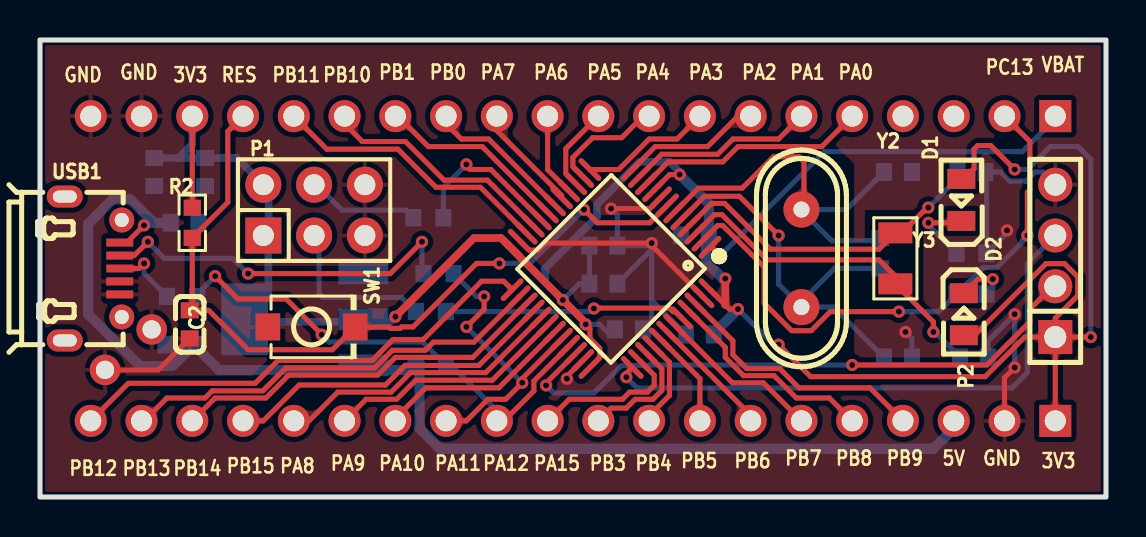
[diagram p3: board, top side]
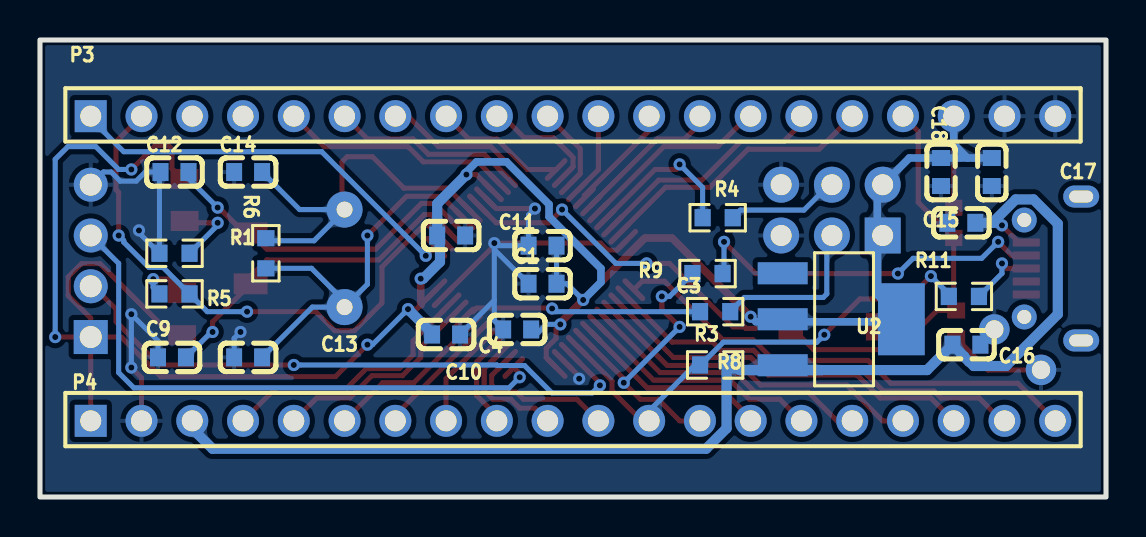
[diagram p4: board, bottom side, seen from below]

Outline 53.34 x 22.86 mm; copper layers: Top Layer, Bottom Layer. Coordinates in mm from the lower left corner of the outline.
Outline path: rectangle 0,22.86 53.34,0
Stack: Top Layer 0.035mm / Dielectric1 1.51mm FR4 er 4.5 / Bottom Layer 0.035mm

## Design rules (mm)
template: JLCPCB Capability(Two Layers Board)
spacing copperThickness1oz (default): track to track 0.102, other pairs 0.152 to 0.3
spacing copperThickness2oz: track to track 0.203, other pairs 0.152 to 0.3
track width copperThickness1oz (default): min 0.127, default 0.254, max 2.54
track width copperThickness2oz: min 0.203, default 0.254, max 2.54
differential pair differentialPair (default): width min 0.127, default 0.254, max 2.54; gap min 0.152, default 0.152
via viaSize (default): diameter min 0.5, default 0.61, max 10; hole min 0.3, default 0.305, max 6.3

## Placement (name value [footprint] x y rotation side)
C1  100nF  [C0603]  28.19 10.67 180 bottom
C2  1uF  [C0603]  7.49 8.64 90 top
C3  100nF  [C0603]  28.19 12.57 180 bottom
C4  100nF  [C0603]  33.02 8.13 0 bottom
C9  20pF  [C0603]  46.74 6.98 180 bottom
C10  100nF  [C0603]  29.46 8.38 180 bottom
C11  100nF  [C0603]  32.77 13.08 0 bottom
C12  20pF  [C0603]  46.61 16.26 180 bottom
C13  20pF  [C0603]  42.93 6.98 180 bottom
C14  20pF  [C0603]  42.93 16.26 180 bottom
C15  100nF  [C0603]  7.24 13.72 180 bottom
C16  100nF  [C0603]  6.98 7.62 0 bottom
C17  100nF  [C0603]  5.72 16.26 90 bottom
C18  100nF  [C0603]  8.25 16.26 90 bottom
D1  KT-0805G  [LED0805-R-RD]  46.1 14.86 90 top
D2  KT-0805G  [LED0805-R-RD]  46.23 9.14 270 top
NOREF  -  [Pad_e2036]  5.59 8.38 0 top
NOREF#2  -  [Pad_e2029]  3.25 6.36 0 top
P1  双排针蓝A_HEADER3X2  [HDR-TH_6P-P2.54-V-M-R2-C3-S2.54-1]  13.72 14.35 0 top
P2  PZ254V-11-04P  [HDR-TH_4P-P2.54-V-M]  50.8 11.81 90 top
P3  ZX-PZ2.54-1-20PZZ  [HDR-TH_20P-P2.54-V-M]  26.67 19.05 180 bottom
P4  ZX-PZ2.54-1-20PZZ  [HDR-TH_20P-P2.54-V-M]  26.67 3.81 180 bottom
R1  510Ω  [R0603]  46.61 12.19 0 bottom
R2  10kΩ  [R0603]  7.62 13.72 270 top
R3  100kΩ  [R0603]  19.56 9.27 180 bottom
R4  100kΩ  [R0603]  19.43 13.97 0 bottom
R5  510Ω  [R0603]  46.61 10.16 180 bottom
R6  1MΩ  [R0603]  42.04 12.19 90 bottom
R8  10K  [R0603]  19.56 6.6 0 bottom
R9  20Ω  [R0603]  19.94 11.18 0 bottom
R11  20Ω  [R0603]  7.11 10.03 0 bottom
SW1  TS-1088-AR02016  [SW-SMD_L3.9-W3.0-P4.45]  13.59 8.51 0 top
U1  STM32F103C8T6  [LQFP-48_L7.0-W7.0-P0.50-LS9.0-BL]  28.57 11.43 135 top
U2  AMS1117-3.3  [SOT-223-3_L6.5-W3.4-P2.30-LS7.0-BR]  13.21 8.89 0 bottom
USB1  MICRO-USB-1  [MICRO-USB-SMD_C9900008946]  2.67 11.43 270 top
Y2  8MHz  [HC-49U_L10.9-W4.5-P4.88]  38.1 11.94 270 top
Y3  32.768K/12.5PF  [CRYSTAL-SMD_L3.2-W1.5-1]  42.8 11.94 270 top

## Footprints (pads in the part's own frame, mm; a bottom-side part is the same pattern mirrored in y, then rotated)
C0603
  rect 0.8x0.9 smd: 1(-0.7,0) 2(0.7,0)
CRYSTAL-SMD_L3.2-W1.5-1
  rect 1.05x1.7 smd: 1(-1.275,0) 2(1.275,0)
HC-49U_L10.9-W4.5-P4.88
  round 1.8 hole 0.8: 1(-2.44,0) 2(2.44,0)
HDR-TH_4P-P2.54-V-M
  rect 1.7x1.7 hole 1.1: 1(-3.81,0)
  round 1.7 hole 1.1: 2(-1.27,0) 3(1.27,0) 4(3.81,0)
HDR-TH_6P-P2.54-V-M-R2-C3-S2.54-1
  rect 1.8x1.8 hole 1.05: 1(-2.54,-1.27)
  round 1.8 hole 1.05: 2(-2.54,1.27) 3(0,-1.27) 4(0,1.27) 5(2.54,-1.27) 6(2.54,1.27)
HDR-TH_20P-P2.54-V-M
  rect 1.6x1.6 hole 1.05: 1(-24.13,0)
  round 1.6 hole 1.05: 2(-21.59,0) 3(-19.05,0) 4(-16.51,0) 5(-13.97,0) 6(-11.43,0) 7(-8.89,0) 8(-6.35,0) 9(-3.81,0) 10(-1.27,0) 11(1.27,0) 12(3.81,0) 13(6.35,0) 14(8.89,0) 15(11.43,0) 16(13.97,0) 17(16.51,0) 18(19.05,0) 19(21.59,0) 20(24.13,0)
LED0805-R-RD
  rect 1x1.399 smd: 1(1.05,0) 2(-1.05,0)
LQFP-48_L7.0-W7.0-P0.50-LS9.0-BL
  oval 0.27x1.5 smd: 1(-2.75,-4.25) 2(-2.25,-4.25) 3(-1.75,-4.25) 4(-1.25,-4.25) 5(-0.75,-4.25) 6(-0.25,-4.25) 7(0.25,-4.25) 8(0.75,-4.25) 9(1.25,-4.25) 10(1.75,-4.25) 11(2.25,-4.25) 12(2.75,-4.25) 25(2.75,4.25) 26(2.25,4.25) 27(1.75,4.25) 28(1.25,4.25) 29(0.75,4.25) 30(0.25,4.25) 31(-0.25,4.25) 32(-0.75,4.25) 33(-1.25,4.25) 34(-1.75,4.25) 35(-2.25,4.25) 36(-2.75,4.25)
  oval 1.5x0.27 smd: 13(4.25,-2.75) 14(4.25,-2.25) 15(4.25,-1.75) 16(4.25,-1.25) 17(4.25,-0.75) 18(4.25,-0.25) 19(4.25,0.25) 20(4.25,0.75) 21(4.25,1.25) 22(4.25,1.75) 23(4.25,2.25) 24(4.25,2.75) 37(-4.25,2.75) 38(-4.25,2.25) 39(-4.25,1.75) 40(-4.25,1.25) 41(-4.25,0.75) 42(-4.25,0.25) 43(-4.25,-0.25) 44(-4.25,-0.75) 45(-4.25,-1.25) 46(-4.25,-1.75) 47(-4.25,-2.25) 48(-4.25,-2.75)
MICRO-USB-SMD_C9900008946
  rect 0.4x1.35 smd: 1(-1.3,1.325) 2(-0.65,1.325) 3(0,1.325) 4(0.65,1.325) 5(1.3,1.325)
  oval 1.1x1.8 hole 0.6x1.2: 6(-3.6,-1.425) 6(3.6,-1.425)
  round 1.25 hole 0.7: 6(-2.425,1.425) 6(2.425,1.425)
Pad_e2029
  round 1.524 hole 0.914: 1(0,0)
Pad_e2036
  round 1.524 hole 0.914: 1(0,0)
R0603
  rect 0.806x0.864 smd: 1(-0.753,0) 2(0.753,0)
SOT-223-3_L6.5-W3.4-P2.30-LS7.0-BR
  rect 2.5x1.1 smd: 1(2.97,-2.3) 2(2.97,0) 3(2.97,2.3)
  rect 2.34x3.6 smd: 4(-2.97,0)
SW-SMD_L3.9-W3.0-P4.45
  rect 1.23x1.36 smd: 1(-2.185,0) 2(2.185,0)

## Nets
As in the schematic, except:
GND: C1.1 C2.1 C3.1 C4.1 C9.1 C10.1 C11.1 C12.1 C13.1 C14.1 C15.1 C16.1 C17.1 C18.1 NOREF.1 NOREF#2.1 P1.5 P1.6 P2.4 P3.19 P3.20 P4.2 R1.2 SW1.1 U1.8 U1.23 U1.35 U1.47 U2.1 USB1.4 USB1.5

Pads without a net: P3 3 4; USB1 6

## Via types
v1: diameter 0.61, hole 0.305, Top Layer to Bottom Layer, 41 vias

## Routing (per net, layer and track width the routed paths; a pad name or vN(x,y) marks a point on that pad's centre or on a via; arc(x,y) is an arc through that point)
5V: length 63.2
  Top Layer w0.254: v1(5.21,13.59) 4.35,12.73 USB1.1
  Bottom Layer w0.254: v1(5.21,13.59) 6.41,13.59 C15.2
  Bottom Layer w0.508: 18.99,6.66 19.04,6.61 18.99,6.61 ; 18.99,6.66 18.99,6.61 ; 18.99,6.66 18.8,6.84 ; 18.99,6.61 18.99,3.44 20.01,2.41 44.7,2.41 45.72,3.43 P4.3 ; 18.8,6.84 R8.1 18.98,6.6 ; 18.8,6.84 18.31,6.35 8.96,6.35 C16.2 7.09,7.03 7.09,7 6.85,6.76 6.83,6.76 6.62,6.55 5,6.55 2.41,9.14 2.41,13.67 3.63,14.89 4.52,14.89 5.69,13.72 C15.2
GND: length 53.3
  Top Layer w0.254: C2.1 5.91,6.35 3.43,6.35 ; 23.98,12.84 24.47,12.35 24.94,12.35 25.29,12.7 v1(30.61,12.7) 30.61,12.58 U1.47 ; P4.2 48.26,5.97 v1(48.77,6.48) ; v1(28.57,14.43) 30.51,14.43 U1.8 ; v1(26.36,5.92) 26.36,6.04 U1.35
  Bottom Layer w0.254: 29.91,8.13 30.61,8.83 30.61,9.84 ; P2.4 50.16,16.26 49.78,16.26 49.32,15.8 48.53,15.8 48.07,16.26 C12.1 47.36,16.2 R1.2 48.39,13.22 v1(48.39,13.33) ; C9.1 47.44,7.81 v1(48.77,9.14) v1(48.77,6.48) ; 30.61,12.38 30.61,9.84 ; 30.61,12.38 C1.1 ; 30.61,12.38 30.61,12.64 ; 30.61,9.84 C4.1 ; C13.1 43.63,7.94 v1(43.31,8.25) ; v1(28.57,14.43) 28.89,14.11 C3.1 30.54,12.57 30.61,12.64 ; NOREF.1 6.28,7.69 C16.1 ; 30.61,12.64 v1(30.61,12.7)
VBAT: length 20.4
  Top Layer w0.254: v1(34.04,12.06) 33.61,12.49 U1.1
  Bottom Layer w0.254: v1(34.04,12.06) 39.24,17.27 49.15,17.27 50.8,18.92 P3.1
VCC3V3: length 125.9
  Top Layer w0.254: v1(52.58,8) P2.1 ; P2.1 P4.1 ; P2.1 49.27,8 47.29,6.02 38.56,6.02 v1(36.96,7.62) ; P2.1 50.8,8.94 51.93,10.07 51.93,11.01 51.27,11.67 50.33,11.67 46.76,8.09 D2.1 ; v1(48.77,16.38) 47.57,17.58 46.92,17.58 46.74,17.4 46.74,16.42 46.23,15.91 ; U1.9 31.51,16.13 v1(32,16.13) ; U1.36 28.01,6.98 28.01,7.44 27.51,7.94 27.51,8.43 v1(27.31,8.64) ; U1.48 34.5,9.4 v1(34.93,9.4) ; R2.1 P3.18
  Top Layer w0.381: 34.28,9.61 34.29,9.61 v1(34.29,10.92) ; v1(27.31,8.64) 27.31,8.71 v1(26.16,9.86) 23.06,12.95 21.72,12.95 v1(17.78,9.02)
  Bottom Layer w0.254: 28.51,8.13 28,8.64 v1(27.31,8.64) ; v1(52.58,8) 52.58,16.89 51.94,17.53 50.55,17.53 49.4,16.38 v1(48.77,16.38) ; 11.38,13 11.43,12.95 ; v1(26.16,9.86) 26.97,10.67 C1.2 C3.2 ; 11.43,15.49 11.38,15.45 ; v1(34.93,9.4) 36.7,7.62 v1(36.96,7.62) ; 17.53,8.76 v1(17.78,9.02)
  Bottom Layer w0.381: 11.44,15.38 11.44,13.06 11.38,13 ; v1(26.16,9.86) 25.27,10.74 25.27,11.43 27.87,14.02 27.87,14.64 30,16.76 31.5,16.76 32,16.26 v1(32,16.13) ; 6.93,16.96 C18.2 9.84,16.96 P1.2 ; 6.93,16.96 C17.2 ; 6.93,16.96 7.62,17.65 P3.18 ; 17.53,8.76 10.09,8.76 11.43,10.1 11.43,12.95
  Bottom Layer w0.508: v1(32,16.13) 33.47,14.67 C11.2 33.34,12.95 33.34,12.37 33.32,12.36 33.32,11.76 34.16,10.92 v1(34.29,10.92) ; v1(34.93,9.4) 33.72,8.19 C4.2
BOOT0: length 12.1
  Top Layer w0.254: v1(27.72,9.43) 27.74,9.45 31.49,9.45 31.67,9.27 31.79,9.27 U1.44
  Bottom Layer w0.254: R3.1 27.56,9.27 v1(27.72,9.43)
BOOT1: length 8
  Top Layer w0.254: U1.20 22.56,16.38 21.52,16.38 21.34,16.56 v1(21.34,16.64)
  Bottom Layer w0.254: R4.2 20.18,15.49 v1(21.34,16.64)
OSCIN: length 20.3
  Top Layer w0.254: U1.5 33.25,15.04 35,15.04 v1(36.96,13.08)
  Bottom Layer w0.254: Y2.2 39.71,9.5 C13.2 ; Y2.2 38.1,9.79 39.75,11.44 R6.1 ; Y2.2 36.96,10.64 v1(36.96,13.08)
OSCOUT: length 19.7
  Top Layer w0.254: U1.6 32.95,15.45 35.13,15.45 36.7,17.02 37.97,17.02 38.23,16.76 38.23,14.5 Y2.1
  Bottom Layer w0.254: R6.2 41.91,12.82 39.62,12.82 38.1,14.34 Y2.1 40.35,14.38 C14.2
PA0: length 11.7
  Top Layer w0.254: U1.10 31.43,16.76 34.16,16.76 34.93,17.53 39.12,17.53 P3.5
PA1: length 9.4
  Top Layer w0.254: 29.99,16.03 31.11,17.14 33.91,17.14 34.67,17.91 36.96,17.91 P3.6
PA2: length 7
  Top Layer w0.254: P3.7 34.93,19.05 33.4,17.53 30.78,17.53 U1.12
PA3: length 6.6
  Top Layer w0.254: U1.13 28.95,16.38 30.48,17.91 31.88,17.91 P3.8
PA4: length 5.8
  Top Layer w0.254: P3.9 30.18,19.05 29.11,17.97 27.65,17.97 26.67,16.99 26.67,16.52 U1.14
PA5: length 4.3
  Top Layer w0.254: U1.15 26.31,16.17 26.31,17.42 P3.10
PA6: length 4.2
  Top Layer w0.254: P3.11 25.4,16.37 U1.16
PA7: length 5.4
  Top Layer w0.254: P3.12 22.86,18.33 26.1,15.09 U1.17
PA8: length 14.5
  Top Layer w0.254: P4.16 13.46,3.81 14.9,5.25 17.56,5.25 18.54,6.22 22.31,6.22 U1.29
PA9: length 12.1
  Top Layer w0.254: P4.15 16.32,4.89 17.84,4.89 18.8,5.84 22.63,5.84 25.39,8.6
PA10: length 9.9
  Top Layer w0.254: P4.14 17.78,3.94 19.3,5.46 22.96,5.46 U1.31
PA11: length 15.4
  Top Layer w0.254: U1.32 24.13,5.92 v1(24.13,5.72) 23.3,4.89 22.41,4.89 21.33,3.81 P4.13 ; v1(22.22,10.03) 22.22,9.4 v1(21.34,8.51)
  Bottom Layer w0.254: v1(22.22,10.03) 21.84,10.03 R9.2 ; v1(21.34,8.51) v1(24.13,5.72)
PA12: length 24.2
  Top Layer w0.254: v1(8.76,11.05) 9.91,9.91 12.32,9.91 14.1,8.13 v1(14.1,8.12) ; U1.33 24.71,5.8 24.71,5.3 23.41,4 23.05,4 P4.12
  Bottom Layer w0.254: P4.12 22.86,4.31 20.31,6.86 20.03,6.86 19.15,7.75 14.47,7.75 v1(14.1,8.12) ; v1(8.76,11.05) 7.87,10.15 R11.2
PA15: length 7.6
  Top Layer w0.254: P4.11 26.48,4.89 29.15,4.89 29.5,5.25 30.39,5.25 30.73,5.59 30.73,6.09 29.99,6.83
PB0: length 7.5
  Top Layer w0.254: P3.13 20.32,18.67 21.08,17.91 22.45,17.91 U1.18
PB1: length 9.6
  Top Layer w0.254: 25.39,14.26 22.13,17.53 19.43,17.53 17.91,19.05 P3.14
PB3: length 6
  Top Layer w0.254: P4.10 28.57,4.44 29.34,4.44 29.78,4.89 30.67,4.89 31.12,5.33 31.12,6.42 U1.39
PB4: length 4.5
  Top Layer w0.254: U1.40 31.5,6.74 31.5,5.08 30.48,4.06 P4.9
PB5: length 4.9
  Top Layer w0.254: U1.41 33.02,5.92 P4.8
PB6: length 6.2
  Top Layer w0.254: U1.42 35.56,4.09 P4.7
PB7: length 8.3
  Top Layer w0.254: P4.6 36.2,5.71 34.65,5.71 U1.43
PB8: length 10.7
  Top Layer w0.254: U1.45 34.29,7.48 34.29,6.98 35.21,6.07 36.73,6.07 37.85,4.95 39.5,4.95 P4.5
PB9: length 13.2
  Top Layer w0.254: U1.46 34.67,7.81 34.67,7.11 35.36,6.42 37.01,6.42 37.97,5.46 41.53,5.46 P4.4
PB10: length 11.9
  Top Layer w0.254: P3.15 15.24,18.67 16.13,17.78 18.29,17.78 20.22,15.85 22.39,15.85 U1.21
PB11: length 14.1
  Top Layer w0.254: P3.16 14.35,17.4 17.91,17.4 19.81,15.49 22.04,15.49 U1.22
PB12: length 24.2
  Top Layer w0.254: U1.25 23.2,10.8 22.1,10.8 19.18,7.87 17.66,7.87 16.62,6.83 11.91,6.83 10.77,5.69 4.42,5.69 P4.20
PB13: length 21.5
  Top Layer w0.254: 23.98,10.02 23.98,10.01 23.97,10.01 21.71,7.75 19.69,7.75 19.28,7.34 17.63,7.34 16.74,6.45 12.3,6.45 11.94,6.1 11.94,6.1 11.15,5.31 8.62,5.31 8.26,4.95 6.35,4.95 5.21,3.81 P4.19
PB14: length 19.1
  Top Layer w0.254: P4.18 8.76,4.95 11.3,4.95 12.45,6.1 16.89,6.1 17.78,6.98 21.66,6.98 U1.27
PB15: length 16.8
  Top Layer w0.254: U1.28 21.96,6.58 18.26,6.58 17.28,5.6 12.97,5.6 11.17,3.81 P4.17
PC13: length 28.3
  Top Layer w0.254: P3.2 49.53,17.78 49.53,15.37 49.4,15.24 v1(49.4,13.08) ; U1.2 33.91,13.58 34.16,13.58 36.23,11.51 36.23,9.7 37.61,8.32 38.59,8.32 39.54,9.27 v1(42.98,9.27)
  Bottom Layer w0.254: v1(42.98,9.27) 44.97,9.27 R5.2 47.18,11.48 47.88,11.48 49.15,12.75 49.15,12.83 v1(49.4,13.08)
PC14: length 17.1
  Top Layer w0.254: v1(44.7,8.25) 44.7,8.76 Y3.2 42.8,11.04 41.98,11.86 36.38,11.86 34.12,14.12 33.74,14.12 U1.3
  Bottom Layer w0.254: C9.2 44.77,8.25 v1(44.7,8.25)
PC15: length 16.7
  Top Layer w0.254: U1.4 32.47,13.55 33.61,14.69 34.26,14.69 36.55,12.39 41.98,12.39 42.8,13.21 43.12,13.21 44.21,14.3 44.27,14.3 v1(44.45,14.48)
  Bottom Layer w0.254: 45.91,16.26 45.91,15.94 v1(44.45,14.48)
RESET: length 39.2
  Top Layer w0.254: v1(27.22,14.38) 27.88,13.72 30.51,13.72 U1.7 ; P3.17 9.4,18.29 9.4,14.74 R2.2 7.62,9.46 C2.2 8.44,9.34 10.41,7.37 14.63,7.37 SW1.2 17.46,8.51 17.54,8.43 18.02,8.43 18.1,8.51 18.67,8.51 21.84,11.68 v1(22.99,11.68)
  Bottom Layer w0.254: v1(27.22,14.38) 24.53,11.68 v1(22.99,11.68)
SWCLK: length 28.6
  Top Layer w0.254: U1.37 29.34,6.18 v1(29.34,5.99)
  Bottom Layer w0.254: v1(29.34,5.99) 29.87,5.46 48.64,5.46 49.4,6.22 49.4,11.68 P2.3
SWIO: length 30.4
  Top Layer w0.254: v1(40.64,6.6) 47.37,6.6 49.53,8.76 49.53,9.4 50.67,10.54 P2.2 ; v1(25.32,5.59) 25.32,5.7 U1.34
  Bottom Layer w0.254: v1(25.32,5.59) 25.7,5.21 27.73,5.21 29.09,6.58 30.45,6.58 30.48,6.6 v1(40.64,6.6)
$1N1147: length 8
  Bottom Layer w0.254: R3.2 18.09,9.98 14.15,9.98 13.97,10.16 13.97,12.95
$1N1213: length 5.3
  Bottom Layer w0.254: R4.1 18.3,14.35 15.11,14.35 13.97,15.49
$1N1574: length 3.9
  Top Layer w0.254: 46.23,13.81 46.14,13.72 v1(44.45,13.72)
  Bottom Layer w0.254: R1.1 44.45,13.6 v1(44.45,13.72)
$1N1677: length 2.6
  Top Layer w0.254: v1(47.68,10.9) 46.93,10.9 D2.2
  Bottom Layer w0.254: v1(47.68,10.9) 47.68,10.47 R5.1
$1N2421: length 18.3
  Top Layer w0.254: USB1.2 4.71,12.08 v1(5.4,12.76) ; v1(10.41,11.18) 17.53,11.18 v1(19.11,12.76)
  Bottom Layer w0.254: v1(5.4,12.76) 6.22,11.94 9.65,11.94 v1(10.41,11.18) ; v1(19.11,12.76) 19.11,11.23 19.06,11.18
$1N2425: length 3.4
  Top Layer w0.254: v1(5.21,11.68) 4.95,11.43 USB1.3
  Bottom Layer w0.254: R11.1 5.21,11.18 v1(5.21,11.68)

## Copper pours and planes (outline as drawn; the poured copper is in the pictures)
GND on Top Layer: -5.33,26.92 59.06,26.92 59.06,-3.3 -5.33,-3.3
GND on Bottom Layer: -6.6,28.07 64.01,28.07 64.01,-4.06 -6.6,-4.06

Small or netless copper shapes (teardrops, artwork), in the pictures only: 93 on Top Layer, 115 on Bottom Layer

## Text on the board
Top Silkscreen Layer: GND | PB12 | PB13 | 3V3 | PB14 | RES | PB15 | PB11 | PA8 | PB10 | PA9 | PB1 | PA10 | PB0 | PA11 | PA7 | PA12 | PA6 | PA15 | PA5 | PB3 | PA4 | PB4 | PB5 | PA3 | PB6 | PA2 | PB7 | PA1 | PB8 | PA0 | PB9 | 5V | PC13 | VBAT
